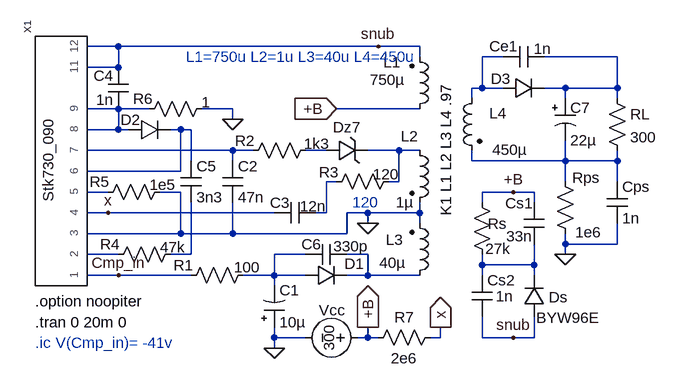
[diagram p0: schematic Ctc184_187.asc]
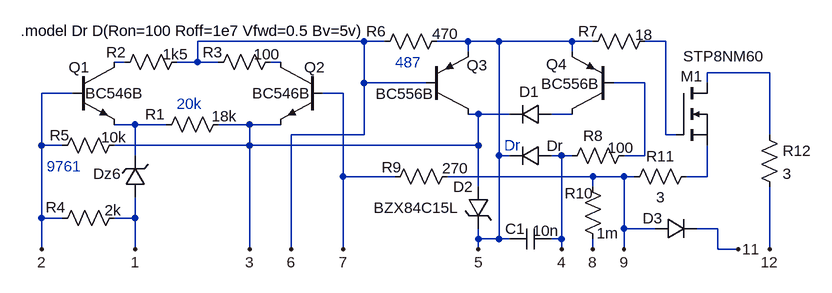
[diagram p1: sub-circuit stk730_090.asc]
Ctc184_187.asc, the LTspice schematic file:
Version 4
SHEET 1 880 680
WIRE -32 0 -80 0
WIRE 368 0 -32 0
WIRE 432 0 368 0
WIRE 432 16 432 0
WIRE 560 16 528 16
WIRE 736 16 624 16
WIRE -32 32 -32 0
WIRE -32 32 -80 32
WIRE 528 64 528 16
WIRE 528 64 512 64
WIRE 560 64 528 64
WIRE 656 64 624 64
WIRE 736 64 736 16
WIRE 736 64 656 64
WIRE 512 80 512 64
WIRE 656 80 656 64
WIRE 736 80 736 64
WIRE -32 96 -80 96
WIRE 16 96 -32 96
WIRE 144 96 96 96
WIRE 432 96 304 96
WIRE 144 112 144 96
WIRE -32 128 -32 96
WIRE -32 128 -80 128
WIRE -16 128 -32 128
WIRE 64 128 48 128
WIRE 80 128 64 128
WIRE 144 160 -80 160
WIRE 176 160 144 160
WIRE 288 160 256 160
WIRE 400 160 352 160
WIRE 432 160 400 160
WIRE 80 176 80 128
WIRE 144 176 144 160
WIRE 512 176 512 160
WIRE 656 176 656 144
WIRE 656 176 512 176
WIRE 736 176 736 160
WIRE 736 176 656 176
WIRE 64 192 64 128
WIRE 64 192 -80 192
WIRE 304 208 288 208
WIRE 400 208 400 160
WIRE 400 208 384 208
WIRE 656 208 656 176
WIRE 736 208 736 176
WIRE -48 224 -80 224
WIRE 64 224 32 224
WIRE 576 224 528 224
WIRE 608 224 576 224
WIRE 528 240 528 224
WIRE 608 240 608 224
WIRE -48 256 -80 256
WIRE 208 256 -48 256
WIRE 288 256 288 208
WIRE 288 256 272 256
WIRE 352 256 320 256
WIRE 432 256 432 240
WIRE 432 256 352 256
WIRE 352 272 352 256
WIRE 432 272 432 256
WIRE 64 288 64 224
WIRE 64 288 -80 288
WIRE 144 288 144 240
WIRE 144 288 64 288
WIRE 320 288 320 256
WIRE 320 288 144 288
WIRE 656 304 656 288
WIRE 736 304 736 272
WIRE 736 304 656 304
WIRE -32 320 -80 320
WIRE 80 320 80 240
WIRE 80 320 48 320
WIRE 256 320 208 320
WIRE 352 320 320 320
WIRE 656 320 656 304
WIRE 528 336 528 320
WIRE 608 336 608 304
WIRE 608 336 528 336
WIRE -32 352 -80 352
WIRE 80 352 -32 352
WIRE 208 352 208 320
WIRE 208 352 160 352
WIRE 256 352 208 352
WIRE 352 352 352 320
WIRE 352 352 320 352
WIRE 432 352 352 352
WIRE 528 352 528 336
WIRE 608 352 608 336
WIRE 208 368 208 352
WIRE 208 448 208 432
WIRE 256 448 208 448
WIRE 352 448 352 432
WIRE 352 448 336 448
WIRE 368 448 352 448
WIRE 464 448 464 432
WIRE 464 448 448 448
WIRE 528 448 528 416
WIRE 576 448 528 448
WIRE 608 448 608 416
WIRE 608 448 576 448
WIRE 208 464 208 448
FLAG 208 464 0
FLAG 352 272 0
FLAG 144 112 0
FLAG 656 320 0
FLAG -48 256 x
FLAG 352 432 +B
IOPIN 352 432 Out
FLAG 464 432 x
IOPIN 464 432 Out
FLAG 304 96 +B
IOPIN 304 96 In
FLAG 368 0 snub
FLAG 576 448 snub
FLAG 576 224 +B
FLAG -32 352 Cmp_in
SYMBOL res 176 336 R90
WINDOW 0 16 108 VBottom 0
WINDOW 3 -12 10 VTop 0
SYMATTR InstName R1
SYMATTR Value 100
SYMBOL polcap 192 432 M180
WINDOW 0 24 57 Left 0
WINDOW 3 24 8 Left 0
SYMATTR InstName C1
SYMATTR Value 10µ
SYMATTR Description Capacitor
SYMATTR Type cap
SYMATTR SpiceLine V=63 Irms=170m Rser=1 Lser=0 mfg="Nichicon" pn="UPG1J100MPH" type="Al electrolytic"
SYMBOL diode 256 368 R270
WINDOW 0 18 75 VTop 0
WINDOW 3 0 32 Invisible 0
SYMATTR InstName D1
SYMATTR Value MURS120
SYMBOL ind2 416 368 M180
WINDOW 0 -36 71 Left 0
WINDOW 3 -46 35 Left 0
SYMATTR InstName L3
SYMATTR Value 40µ
SYMATTR SpiceLine Rser=0.1 Cpar=2p
SYMBOL ind2 416 144 R0
WINDOW 0 -13 -6 Left 0
WINDOW 3 -21 96 Left 0
SYMATTR InstName L2
SYMATTR Value 1µ
SYMATTR SpiceLine Rser=10m Cpar=1p
SYMBOL zener 288 176 R270
WINDOW 0 36 32 VTop 0
WINDOW 3 -4 32 Invisible 0
SYMATTR InstName Dz7
SYMATTR Value 1N755
SYMBOL res 272 144 R90
WINDOW 0 17 109 VBottom 0
WINDOW 3 -10 -1 VTop 0
SYMATTR InstName R2
SYMATTR Value 1k3
SYMBOL cap 128 176 R0
SYMATTR InstName C2
SYMATTR Value 47n
SYMBOL res 400 192 R90
WINDOW 0 17 108 VBottom 0
WINDOW 3 -11 20 VTop 0
SYMATTR InstName R3
SYMATTR Value 120
SYMBOL cap 272 240 R90
WINDOW 0 16 55 VBottom 0
WINDOW 3 -10 4 VTop 0
SYMATTR InstName C3
SYMATTR Value 12n
SYMBOL cap -48 32 R0
WINDOW 0 -22 13 Left 0
WINDOW 3 -18 50 Left 0
SYMATTR InstName C4
SYMATTR Value 1n
SYMBOL diode -16 144 R270
WINDOW 0 16 3 VTop 0
WINDOW 3 43 65 Invisible 0
SYMATTR InstName D2
SYMATTR Value MURS120
SYMBOL cap 64 176 R0
SYMATTR InstName C5
SYMATTR Value 3n3
SYMBOL res 64 304 R90
WINDOW 0 16 109 VBottom 0
WINDOW 3 -11 12 VTop 0
SYMATTR InstName R4
SYMATTR Value 47k
SYMBOL res 48 208 R90
WINDOW 0 16 109 VBottom 0
WINDOW 3 -11 12 VTop 0
SYMATTR InstName R5
SYMATTR Value 1e5
SYMBOL res 112 80 R90
WINDOW 0 16 106 VBottom 0
WINDOW 3 -10 9 VTop 0
SYMATTR InstName R6
SYMATTR Value 1
SYMBOL cap 320 304 R90
WINDOW 0 16 55 VBottom 0
WINDOW 3 -12 -6 VTop 0
SYMATTR InstName C6
SYMATTR Value 330p
SYMBOL ind2 416 112 M180
WINDOW 0 -40 88 Left 0
WINDOW 3 -61 61 Left 0
SYMATTR InstName L1
SYMATTR Value 750µ
SYMATTR SpiceLine Rser=1 Cpar=10p
SYMBOL voltage 352 448 R90
WINDOW 0 -58 55 VTop 0
WINDOW 3 0 75 Bottom 0
WINDOW 123 0 0 Left 0
SYMATTR InstName Vcc
SYMATTR Value 300
SYMATTR SpiceLine Rser=1 Cpar=10u
SYMBOL diode 560 80 R270
WINDOW 0 15 -3 VTop 0
WINDOW 3 -79 219 Invisible 0
SYMATTR InstName D3
SYMATTR Value MURS320
SYMBOL cap 624 0 R90
WINDOW 0 15 63 VBottom 0
WINDOW 3 -12 3 VTop 0
SYMATTR InstName Ce1
SYMATTR Value 1n
SYMBOL polcap 640 80 R0
WINDOW 3 24 64 Left 0
WINDOW 0 24 14 Left 0
SYMATTR Value 22µ
SYMATTR InstName C7
SYMATTR Description Capacitor
SYMATTR Type cap
SYMATTR SpiceLine V=200 Irms=500m Rser=0.1 Lser=0
SYMBOL ind2 528 64 M0
WINDOW 0 -38 39 Left 0
WINDOW 3 -70 95 Left 0
SYMATTR InstName L4
SYMATTR Value 450µ
SYMATTR SpiceLine Rser=1 Cpar=5p
SYMBOL res 720 64 R0
SYMATTR InstName RL
SYMATTR Value 300
SYMBOL res 640 192 R0
WINDOW 0 27 10 Left 0
WINDOW 3 31 94 Left 0
SYMATTR InstName Rps
SYMATTR Value 1e6
SYMBOL res 352 464 R270
WINDOW 0 32 56 VTop 0
WINDOW 3 0 56 VBottom 0
SYMATTR InstName R7
SYMATTR Value 2e6
SYMBOL Stk730_090 -112 176 R270
SYMATTR InstName X1
SYMBOL cap 720 208 R0
SYMATTR InstName Cps
SYMATTR Value 1n
SYMBOL cap 592 240 R0
WINDOW 0 -28 1 Left 0
WINDOW 3 -27 52 Left 0
SYMATTR InstName Cs1
SYMATTR Value 33n
SYMBOL res 512 224 R0
WINDOW 0 25 49 Left 0
WINDOW 3 21 87 Left 0
SYMATTR InstName Rs
SYMATTR Value 27k
SYMBOL diode 624 416 R180
WINDOW 0 -36 30 Left 0
WINDOW 3 -84 -1 Left 0
SYMATTR InstName Ds
SYMATTR Value BYW96E
SYMBOL cap 512 352 R0
WINDOW 3 37 32 Left 0
SYMATTR Value 1n
SYMATTR InstName Cs2
TEXT 72 16 Left 0 ;L1=750u L2=1u L3=40u L4=450u
TEXT 472 56 VRight 0 !K1 L1 L2 L3 L4 .97
TEXT -160 424 Left 0 !.tran 0 20m 0
TEXT -160 392 Left 0 !.option noopiter
TEXT -160 456 Left 0 ;.ic V(Cmp_in)= -41v
TEXT 328 240 Left 0 ;120

stk730_090.asc, the sub-circuit schematic file:
Version 4
SHEET 1 1268 680
WIRE 560 64 304 64
WIRE 592 64 560 64
WIRE 720 64 672 64
WIRE 768 64 720 64
WIRE 880 64 768 64
WIRE 912 64 880 64
WIRE 1024 64 992 64
WIRE 720 80 720 64
WIRE 880 80 880 64
WIRE 192 96 176 96
WIRE 304 96 304 64
WIRE 304 96 272 96
WIRE 336 96 304 96
WIRE 432 96 416 96
WIRE 1184 112 1088 112
WIRE 560 128 560 64
WIRE 656 128 560 128
WIRE 992 128 944 128
WIRE 1088 128 1088 112
WIRE 112 144 64 144
WIRE 528 144 496 144
WIRE 736 176 720 176
WIRE 784 176 736 176
WIRE 880 176 848 176
WIRE 208 192 176 192
WIRE 256 192 208 192
WIRE 384 192 336 192
WIRE 432 192 384 192
WIRE 560 208 560 128
WIRE 560 208 448 208
WIRE 1024 208 1024 64
WIRE 1040 208 1024 208
WIRE 1184 208 1184 112
WIRE 64 224 64 144
WIRE 96 224 64 224
WIRE 384 224 384 192
WIRE 384 224 176 224
WIRE 736 224 736 176
WIRE 736 224 384 224
WIRE 208 240 208 192
WIRE 768 240 768 64
WIRE 784 240 768 240
WIRE 864 240 848 240
WIRE 880 240 864 240
WIRE 992 240 992 128
WIRE 992 240 960 240
WIRE 528 272 528 144
WIRE 608 272 528 272
WIRE 912 272 688 272
WIRE 960 272 912 272
WIRE 976 272 960 272
WIRE 1088 272 1088 224
WIRE 1088 272 1056 272
WIRE 736 288 736 224
WIRE 912 288 912 272
WIRE 64 336 64 224
WIRE 96 336 64 336
WIRE 208 336 208 304
WIRE 208 336 176 336
WIRE 960 352 960 272
WIRE 1008 352 960 352
WIRE 1104 352 1072 352
WIRE 736 368 736 352
WIRE 768 368 768 240
WIRE 768 368 736 368
WIRE 784 368 768 368
WIRE 864 368 864 240
WIRE 864 368 848 368
WIRE 64 384 64 336
WIRE 208 384 208 336
WIRE 384 384 384 224
WIRE 448 384 448 208
WIRE 528 384 528 272
WIRE 736 384 736 368
WIRE 864 384 864 368
WIRE 912 384 912 368
WIRE 960 384 960 352
WIRE 1104 384 1104 352
WIRE 1136 384 1104 384
WIRE 1184 384 1184 288
FLAG 64 384 2
FLAG 208 384 1
FLAG 384 384 3
FLAG 528 384 7
FLAG 448 384 6
FLAG 736 384 5
FLAG 864 384 4
FLAG 1184 384 12
FLAG 912 384 8
FLAG 960 384 9
FLAG 1136 384 11
SYMBOL npn2 112 96 R0
WINDOW 0 -6 8 Left 0
WINDOW 3 19 48 Left 0
SYMATTR InstName Q1
SYMATTR Value BC546B
SYMBOL npn2 496 96 M0
WINDOW 0 -4 8 Left 0
WINDOW 3 19 48 Left 0
SYMATTR InstName Q2
SYMATTR Value BC546B
SYMBOL res 352 176 R90
WINDOW 0 16 113 VBottom 0
WINDOW 3 -12 7 VTop 0
SYMATTR InstName R1
SYMATTR Value 18k
SYMBOL res 288 80 R90
WINDOW 0 16 109 VBottom 0
WINDOW 3 -12 18 VTop 0
SYMATTR InstName R2
SYMATTR Value 1k5
SYMBOL res 432 80 R90
WINDOW 0 16 105 VBottom 0
WINDOW 3 -12 21 VTop 0
SYMATTR InstName R3
SYMATTR Value 100
SYMBOL zener 224 304 R180
WINDOW 0 38 36 Left 0
WINDOW 3 24 0 Invisible 0
SYMATTR InstName Dz6
SYMATTR Value BZX84C6V2L
SYMBOL res 192 320 R90
WINDOW 0 15 106 VBottom 0
WINDOW 3 -12 18 VTop 0
SYMATTR InstName R4
SYMATTR Value 2k
SYMBOL res 192 208 R90
WINDOW 0 16 100 VBottom 0
WINDOW 3 -12 17 VTop 0
SYMATTR InstName R5
SYMATTR Value 10k
SYMBOL pnp2 944 176 R180
WINDOW 0 71 77 Left 0
WINDOW 3 22 47 Left 0
SYMATTR InstName Q4
SYMATTR Value BC556B
SYMBOL pnp2 656 176 M180
WINDOW 0 62 75 Left 0
WINDOW 3 -78 31 Left 0
SYMATTR InstName Q3
SYMATTR Value BC556B
SYMBOL res 688 48 R90
WINDOW 0 16 109 VBottom 0
WINDOW 3 -11 3 VTop 0
SYMATTR InstName R6
SYMATTR Value 470
SYMBOL res 1008 48 R90
WINDOW 0 16 103 VBottom 0
WINDOW 3 -10 17 VTop 0
SYMATTR InstName R7
SYMATTR Value 18
SYMBOL diode 848 160 R90
WINDOW 0 -3 34 VBottom 0
WINDOW 3 -10 0 Invisible 0
SYMATTR InstName D1
SYMATTR Value 1N914
SYMBOL res 976 224 R90
WINDOW 0 1 63 VBottom 0
WINDOW 3 -12 21 VTop 0
SYMATTR InstName R8
SYMATTR Value 100
SYMBOL cap 848 352 R90
WINDOW 0 16 55 VBottom 0
WINDOW 3 -12 8 VTop 0
SYMATTR InstName C1
SYMATTR Value 10n
SYMBOL res 704 256 R90
WINDOW 0 17 101 VBottom 0
WINDOW 3 -12 3 VTop 0
SYMATTR InstName R9
SYMATTR Value 270
SYMBOL nmos 1040 128 R0
WINDOW 0 7 -10 Left 0
WINDOW 3 11 -41 Left 0
SYMATTR InstName M1
SYMATTR Value STP8NM60
SYMBOL diode 1008 368 R270
WINDOW 0 16 -4 VTop 0
WINDOW 3 0 32 Invisible 0
SYMATTR InstName D3
SYMATTR Value BYW96E
SYMBOL res 896 272 R0
WINDOW 0 -27 26 Left 0
WINDOW 3 22 87 Left 0
SYMATTR InstName R10
SYMATTR Value 1m
SYMBOL zener 752 288 M0
WINDOW 3 46 32 Left 0
SYMATTR Value BZX84C15L
SYMATTR InstName D2
SYMBOL diode 848 256 M270
WINDOW 0 16 -6 VTop 0
WINDOW 3 -25 37 Invisible 0
SYMATTR InstName Dr
SYMATTR Value 1N914
SYMATTR Description Zener Diode
SYMATTR Type zener
SYMBOL res 1072 256 R90
WINDOW 0 0 56 VBottom 0
WINDOW 3 32 56 VTop 0
SYMATTR InstName R11
SYMATTR Value 3
SYMBOL res 1168 192 R0
SYMATTR InstName R12
SYMATTR Value 3
TEXT 32 48 Left 0 !.model Dr D(Ron=100 Roff=1e7 Vfwd=0.5 Bv=5v)
TEXT 776 224 Left 0 ;Dr
TEXT 272 160 Left 0 ;20k
TEXT 72 256 Left 0 ;9761
TEXT 608 96 Left 0 ;487

The netlist it stands for:
* Ctc184_187.asc
R1 N013 Cmp_in 100
C1 0 N013 10µ V=63 Irms=170m Rser=1 Lser=0 mfg="Nichicon" pn="UPG1J100MPH" type="Al electrolytic"
D1 N013 N014 MURS120
L3 N014 0 40µ Rser=0.1 Cpar=2p
L2 N007 0 1µ Rser=10m Cpar=1p
Dz7 N006 N007 1N755
R2 N006 N005 1k3
C2 N005 0 47n
R3 N007 N009 120
C3 N009 x 12n
C4 snub N003 1n
D2 N003 N004 MURS120
C5 N004 N012 3n3
R4 N012 N011 47k
R5 0 N010 1e5
R6 0 N003 1
C6 N014 N013 330p
L1 +B snub 750µ Rser=1 Cpar=10p
Vcc +B 0 300 Rser=1 Cpar=10u
D3 N001 N002 MURS320
Ce1 N002 N001 1n
C7 N002 N008 22µ V=200 Irms=500m Rser=0.1 Lser=0
L4 N001 N008 450µ Rser=1 Cpar=5p
RL N002 N008 300
Rps N008 0 1e6
R7 +B x 2e6
XX1 Cmp_in N011 0 x N010 N004 N005 N003 N003 snub snub stk730_090 params: Stk730_090
Cps N008 0 1n
Cs1 +B N015 33n
Rs +B N015 27k
Ds snub N015 BYW96E
Cs2 N015 snub 1n

* block symbol definitions
.subckt stk730_090 1 2 3 4 5 6 7 8 9 11 12
Q1 N002 2 N007 0 BC546B
Q2 N003 7 3 0 BC546B
R1 3 N007 18k
R2 6 N002 1k5
R3 N003 6 100
Dz6 1 N007 BZX84C6V2L
R4 1 2 2k
R5 3 2 10k
Q4 N006 N005 5 0 BC556B
Q3 3 6 5 0 BC556B
R6 5 6 470
R7 N001 5 18
D1 N006 3 1N914
R8 N005 4 100
C1 4 5 10n
R9 9 7 270
M1 N004 N001 N008 N008 STP8NM60
D3 9 11 BYW96E
R10 9 8 1m
D2 3 5 BZX84C15L
Dr 4 5 1N914
R11 N008 9 3
R12 N004 12 3
.model Dr D(Ron=100 Roff=1e7 Vfwd=0.5 Bv=5v)
* Dr
* 20k
* 9761
* 487
.ends stk730_090

.model D D
.lib standard.dio
.model NPN NPN
.model PNP PNP
.lib standard.bjt
.model NMOS NMOS
.model PMOS PMOS
.lib standard.mos
* L1=750u L2=1u L3=40u L4=450u
K1 L1 L2 L3 L4 .97
.tran 0 20m 0
.option noopiter
* .ic V(Cmp_in)= -41v
* 120
.backanno
.end